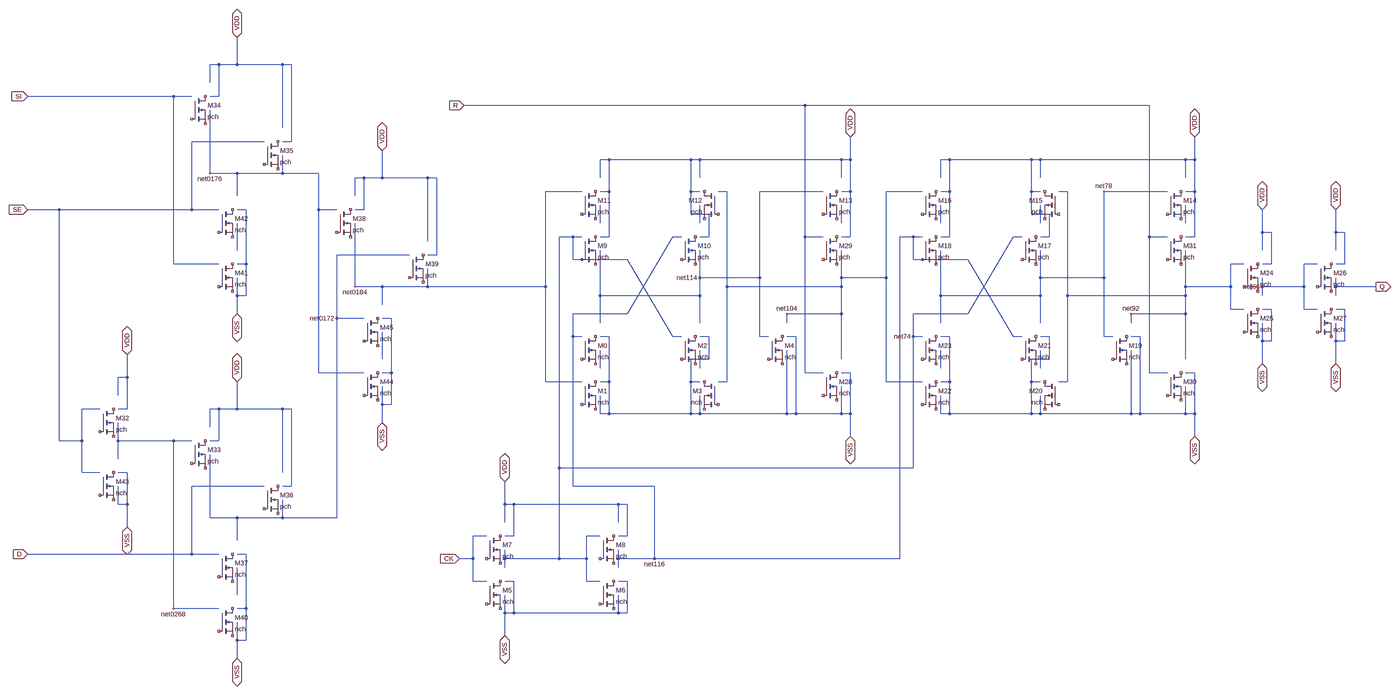
[diagram p0: schematic srff1.asc, whole sheet]
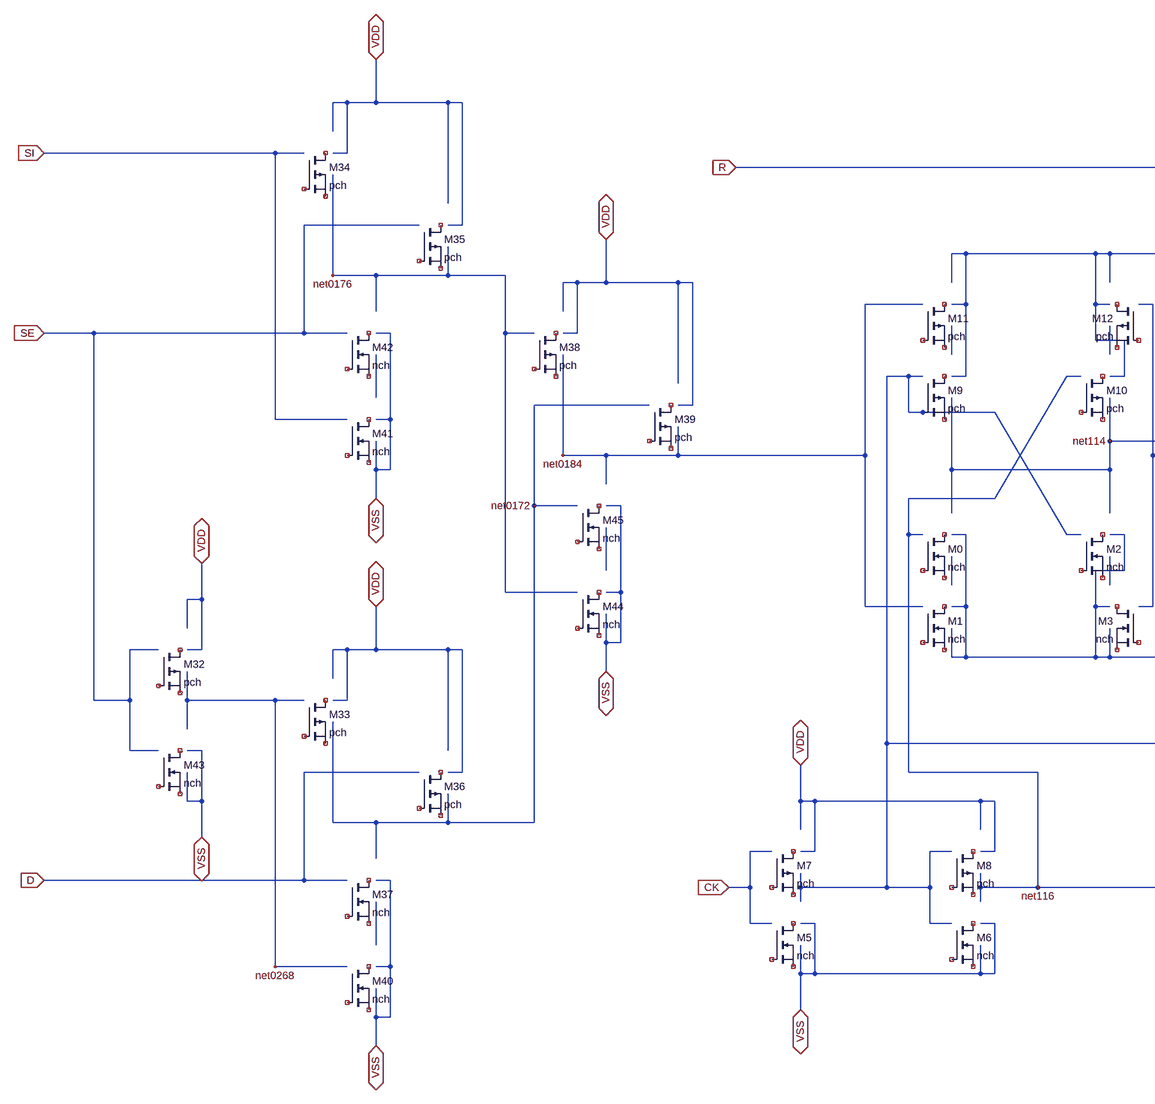
[diagram p1: schematic srff1.asc, part, row 1 of 1, column 1 of 2]
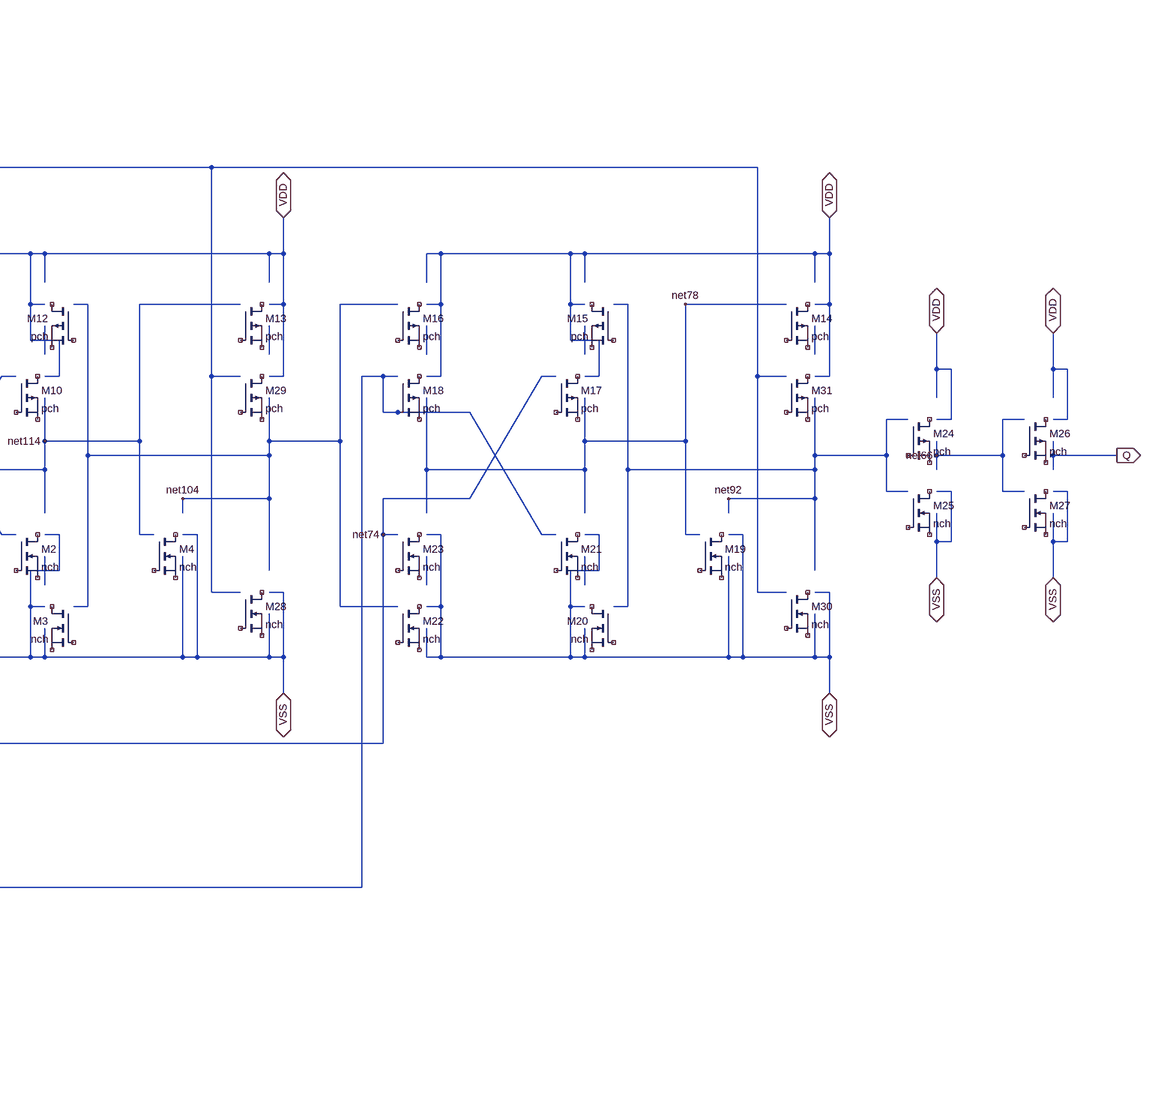
[diagram p2: schematic srff1.asc, part, row 1 of 1, column 2 of 2]
srff1.asc, the LTspice schematic file:
Version 4
SHEET 1 5408 2416
WIRE 960 928 960 736
WIRE 960 1040 960 928
WIRE 928 1040 928 976
WIRE 1440 1120 1472 1120
WIRE 1440 1312 1472 1312
WIRE 1472 1424 1472 1312
WIRE 1440 1424 1472 1424
WIRE 1440 1424 1440 1360
WIRE 1440 1488 1440 1424
WIRE 1472 1312 1472 1120
WIRE 432 1776 432 1856
WIRE 400 1776 432 1776
WIRE 432 1776 432 1664
WIRE 400 1776 400 1712
WIRE 400 1664 432 1664
WIRE 2912 1456 3072 1456
WIRE 3072 1456 3072 1360
WIRE 3104 1456 3104 1312
WIRE 3072 1456 3104 1456
WIRE 4224 1456 4256 1456
WIRE 4416 1456 4416 1360
WIRE 4256 1456 4416 1456
WIRE 4448 1456 4448 1312
WIRE 4416 1456 4448 1456
WIRE 928 1040 960 1040
WIRE 928 1104 928 1040
WIRE 928 1952 960 1952
WIRE 928 2144 960 2144
WIRE 960 2256 960 2144
WIRE 928 2256 960 2256
WIRE 928 2256 928 2192
WIRE 928 2320 928 2256
WIRE 960 2144 960 1952
WIRE 5152 1200 5152 1280
WIRE 5184 1200 5184 1088
WIRE 5152 1200 5184 1200
WIRE 5152 1088 5184 1088
WIRE 5152 1136 5152 1200
WIRE 4880 1200 4880 1280
WIRE 4912 1200 4912 1088
WIRE 4880 1200 4912 1200
WIRE 4880 1088 4912 1088
WIRE 4880 1136 4880 1200
WIRE 3552 1456 3552 1392
WIRE 3552 1456 3584 1456
WIRE 3904 1456 3904 1392
WIRE 3552 1184 3584 1184
WIRE 3584 1456 3872 1456
WIRE 3584 1456 3584 1344
WIRE 3584 1344 3584 1184
WIRE 3552 1344 3584 1344
WIRE 3904 1184 3936 1184
WIRE 3936 1264 3936 1184
WIRE 3872 1264 3936 1264
WIRE 3872 1456 3904 1456
WIRE 3872 1456 3872 1344
WIRE 3872 1344 3872 1264
WIRE 3872 1344 3904 1344
WIRE 4416 1312 4448 1312
WIRE 3904 1456 4224 1456
WIRE 4224 1456 4224 1232
WIRE 4224 1184 4256 1184
WIRE 4256 1456 4256 1184
WIRE 4448 1456 4448 1536
WIRE 1872 2160 1872 2240
WIRE 2272 2160 2304 2160
WIRE 2304 2160 2304 2048
WIRE 2272 2048 2304 2048
WIRE 1904 2160 1904 2048
WIRE 1872 2048 1904 2048
WIRE 1872 2096 1872 2160
WIRE 1872 2160 1904 2160
WIRE 2272 2096 2272 2160
WIRE 3072 1312 3104 1312
WIRE 3104 1456 3104 1536
WIRE 2880 1456 2912 1456
WIRE 2912 1456 2912 1184
WIRE 2880 1184 2912 1184
WIRE 2880 1456 2880 1232
WIRE 2560 1456 2880 1456
WIRE 2528 1344 2560 1344
WIRE 2528 1344 2528 1264
WIRE 2528 1456 2528 1344
WIRE 2528 1456 2560 1456
WIRE 2528 1264 2592 1264
WIRE 2592 1264 2592 1184
WIRE 2560 1184 2592 1184
WIRE 2208 1344 2240 1344
WIRE 2240 1344 2240 1184
WIRE 2240 1456 2240 1344
WIRE 2240 1456 2528 1456
WIRE 2208 1184 2240 1184
WIRE 2560 1456 2560 1392
WIRE 2208 1456 2240 1456
WIRE 2208 1456 2208 1392
WIRE 1904 2160 2272 2160
WIRE 928 736 960 736
WIRE 928 928 960 928
WIRE 4880 1008 5040 1008
WIRE 5040 1008 5040 928
WIRE 4880 1008 4880 976
WIRE 5040 1088 5040 1008
WIRE 5040 1088 5088 1088
WIRE 5040 928 5088 928
WIRE 4880 1040 4880 1008
WIRE 928 1344 928 1440
WIRE 928 1440 1088 1440
WIRE 1088 1440 1120 1440
WIRE 1120 1712 1120 1440
WIRE 1088 1712 1120 1712
WIRE 1088 1664 1088 1440
WIRE 864 1440 928 1440
WIRE 832 1504 832 1440
WIRE 832 1440 864 1440
WIRE 864 1552 864 1440
WIRE 832 1552 864 1552
WIRE 432 1248 432 1328
WIRE 400 1328 432 1328
WIRE 432 1440 432 1328
WIRE 400 1440 432 1440
WIRE 400 1392 400 1328
WIRE 3072 832 3104 832
WIRE 2560 560 3072 560
WIRE 3104 832 3104 672
WIRE 4416 832 4448 832
WIRE 4448 832 4448 672
WIRE 3904 560 4416 560
WIRE 4416 560 4448 560
WIRE 928 128 928 224
WIRE 928 224 1088 224
WIRE 1088 224 1120 224
WIRE 1120 496 1120 224
WIRE 1088 496 1120 496
WIRE 1088 448 1088 224
WIRE 864 224 928 224
WIRE 832 288 832 224
WIRE 832 224 864 224
WIRE 864 336 864 224
WIRE 832 336 864 336
WIRE 1344 736 1376 736
WIRE 1376 736 1376 624
WIRE 1344 624 1376 624
WIRE 1344 688 1344 624
WIRE 1376 624 1440 624
WIRE 1600 624 1632 624
WIRE 1440 624 1600 624
WIRE 1440 528 1440 624
WIRE 1600 896 1632 896
WIRE 1600 848 1600 624
WIRE 1632 896 1632 624
WIRE 5184 928 5184 816
WIRE 5152 816 5184 816
WIRE 5152 928 5184 928
WIRE 5152 880 5152 816
WIRE 5152 816 5152 736
WIRE 4912 928 4912 816
WIRE 4880 816 4912 816
WIRE 4880 928 4912 928
WIRE 4880 880 4880 816
WIRE 4880 816 4880 736
WIRE 3552 624 3552 560
WIRE 3552 560 3584 560
WIRE 3904 624 3904 560
WIRE 3904 832 3936 832
WIRE 3936 832 3936 752
WIRE 3872 752 3936 752
WIRE 3872 560 3904 560
WIRE 3872 752 3872 672
WIRE 3872 672 3872 560
WIRE 3872 672 3904 672
WIRE 3552 832 3584 832
WIRE 3584 560 3872 560
WIRE 3584 832 3584 672
WIRE 3584 672 3584 560
WIRE 3552 672 3584 672
WIRE 4416 624 4416 560
WIRE 4416 672 4448 672
WIRE 4448 672 4448 560
WIRE 4448 560 4448 480
WIRE 1872 1776 1872 1696
WIRE 2272 1776 2304 1776
WIRE 2304 1888 2304 1776
WIRE 2272 1888 2304 1888
WIRE 1904 1888 1904 1776
WIRE 1872 1888 1904 1888
WIRE 2272 1840 2272 1776
WIRE 1872 1840 1872 1776
WIRE 1872 1776 1904 1776
WIRE 3104 560 3104 480
WIRE 3104 672 3104 560
WIRE 3072 672 3104 672
WIRE 3072 624 3072 560
WIRE 3072 560 3104 560
WIRE 2208 672 2240 672
WIRE 2240 672 2240 560
WIRE 2240 832 2240 672
WIRE 2240 560 2528 560
WIRE 2208 832 2240 832
WIRE 2528 672 2560 672
WIRE 2528 672 2528 560
WIRE 2528 752 2528 672
WIRE 2528 560 2560 560
WIRE 2528 752 2592 752
WIRE 2592 832 2592 752
WIRE 2560 832 2592 832
WIRE 2560 624 2560 560
WIRE 2208 560 2240 560
WIRE 2208 624 2208 560
WIRE 1904 1776 2272 1776
WIRE 1440 1072 1440 1008
WIRE 1600 1008 1600 944
WIRE 1344 1008 1440 1008
WIRE 1440 1008 1600 1008
WIRE 1344 1008 1344 784
WIRE 1600 1008 2016 1008
WIRE 2016 1008 2016 672
WIRE 2016 1344 2144 1344
WIRE 2016 1344 2016 1008
WIRE 2016 672 2144 672
WIRE 2944 832 3008 832
WIRE 2944 1312 2944 832
WIRE 2944 1312 3008 1312
WIRE 2944 368 4288 368
WIRE 4288 832 4288 368
WIRE 4288 1312 4352 1312
WIRE 4288 832 4352 832
WIRE 2944 832 2944 368
WIRE 4288 1312 4288 832
WIRE 1728 368 2944 368
WIRE 4416 1104 4416 1040
WIRE 4224 1136 4224 1104
WIRE 4224 1104 4416 1104
WIRE 4416 1040 4416 1008
WIRE 4768 1088 4816 1088
WIRE 4768 928 4816 928
WIRE 4000 1040 4416 1040
WIRE 4416 1008 4416 880
WIRE 4416 1008 4768 1008
WIRE 4416 1264 4416 1104
WIRE 3968 672 4000 672
WIRE 3968 1344 4000 1344
WIRE 4000 1344 4000 1040
WIRE 4000 1040 4000 672
WIRE 4768 1008 4768 928
WIRE 4768 1088 4768 1008
WIRE 928 2096 928 2000
WIRE 928 688 928 608
WIRE 832 608 928 608
WIRE 928 608 1088 608
WIRE 1216 1312 1216 736
WIRE 1216 1312 1376 1312
WIRE 832 608 832 384
WIRE 1088 608 1088 544
WIRE 1216 736 1280 736
WIRE 1216 736 1216 608
WIRE 1088 608 1216 608
WIRE 3456 1184 3488 1184
WIRE 3456 1184 3456 1104
WIRE 3456 1104 3648 1104
WIRE 3808 832 3840 832
WIRE 3648 1104 3808 832
WIRE 2064 1648 3456 1648
WIRE 2064 1648 2064 832
WIRE 2064 1968 2064 1648
WIRE 2064 1968 2160 1968
WIRE 3456 1648 3456 1184
WIRE 2304 912 2464 1184
WIRE 1872 1968 2064 1968
WIRE 2160 1968 2160 1888
WIRE 2064 832 2112 832
WIRE 2160 2048 2160 1968
WIRE 1872 2000 1872 1968
WIRE 2160 1888 2208 1888
WIRE 2160 2048 2208 2048
WIRE 1872 1968 1872 1936
WIRE 2464 1184 2496 1184
WIRE 2112 912 2304 912
WIRE 2112 912 2112 832
WIRE 2112 832 2144 832
WIRE 4128 976 4128 672
WIRE 4128 672 4352 672
WIRE 3552 1136 3552 1040
WIRE 3904 1136 3904 1040
WIRE 3552 1040 3552 880
WIRE 3904 1040 3904 976
WIRE 3552 1040 3904 1040
WIRE 4128 1184 4128 976
WIRE 4128 1184 4160 1184
WIRE 3904 976 3904 880
WIRE 3904 976 4128 976
WIRE 2880 1136 2880 1104
WIRE 3072 1104 3072 1008
WIRE 2880 1104 3072 1104
WIRE 3072 976 3072 880
WIRE 3360 1344 3360 976
WIRE 3072 1008 3072 976
WIRE 3360 672 3488 672
WIRE 2656 1008 3072 1008
WIRE 2656 1008 2656 672
WIRE 3360 1344 3488 1344
WIRE 3072 1264 3072 1104
WIRE 2656 1344 2656 1008
WIRE 2624 1344 2656 1344
WIRE 3072 976 3360 976
WIRE 2624 672 2656 672
WIRE 3360 976 3360 672
WIRE 80 336 704 336
WIRE 704 928 704 336
WIRE 704 336 768 336
WIRE 704 928 864 928
WIRE 1440 1264 1440 1168
WIRE 2208 784 2208 720
WIRE 3904 784 3904 720
WIRE 1712 1968 1760 1968
WIRE 1760 1968 1760 1888
WIRE 1760 2048 1808 2048
WIRE 1760 2048 1760 1968
WIRE 1760 1888 1808 1888
WIRE 3552 784 3552 720
WIRE 3904 1296 3904 1232
WIRE 928 880 928 784
WIRE 2784 976 2784 672
WIRE 2560 976 2784 976
WIRE 2560 976 2560 880
WIRE 2784 1184 2816 1184
WIRE 2784 1184 2784 976
WIRE 2784 672 3008 672
WIRE 2208 1040 2560 1040
WIRE 2560 1040 2560 976
WIRE 2208 1040 2208 880
WIRE 2560 1136 2560 1040
WIRE 2208 1136 2208 1040
WIRE 2560 784 2560 720
WIRE 2208 1296 2208 1232
WIRE 4416 784 4416 720
WIRE 1280 1120 1280 896
WIRE 832 1824 832 1600
WIRE 1088 1824 1088 1760
WIRE 1280 1120 1376 1120
WIRE 1088 1824 1280 1824
WIRE 1280 1824 1280 1120
WIRE 928 1824 1088 1824
WIRE 832 1824 928 1824
WIRE 928 1904 928 1824
WIRE 1280 896 1536 896
WIRE 2400 1968 3408 1968
WIRE 3408 832 3456 832
WIRE 3456 832 3488 832
WIRE 3456 912 3456 832
WIRE 3456 912 3648 912
WIRE 3808 1184 3840 1184
WIRE 3648 912 3808 1184
WIRE 3408 1968 3408 832
WIRE 2272 1968 2272 1936
WIRE 2112 1712 2400 1712
WIRE 2272 1968 2400 1968
WIRE 2400 1968 2400 1712
WIRE 2112 1712 2112 1184
WIRE 2304 1104 2464 832
WIRE 2272 2000 2272 1968
WIRE 2464 832 2496 832
WIRE 2112 1104 2304 1104
WIRE 2112 1184 2112 1104
WIRE 2112 1184 2144 1184
WIRE 2560 1296 2560 1232
WIRE 3552 1296 3552 1232
WIRE 3072 784 3072 720
WIRE 768 1712 1024 1712
WIRE 768 1952 864 1952
WIRE 768 1952 768 1712
WIRE 80 1952 768 1952
WIRE 400 1552 400 1488
WIRE 400 1616 400 1552
WIRE 704 2144 864 2144
WIRE 704 1552 768 1552
WIRE 400 1552 704 1552
WIRE 704 2144 704 1552
WIRE 80 736 192 736
WIRE 768 736 768 496
WIRE 192 736 768 736
WIRE 768 736 864 736
WIRE 192 1552 192 736
WIRE 272 1552 272 1440
WIRE 272 1440 336 1440
WIRE 272 1664 336 1664
WIRE 272 1664 272 1552
WIRE 192 1552 272 1552
WIRE 768 496 1024 496
WIRE 5152 1008 5312 1008
WIRE 5152 1008 5152 976
WIRE 5152 1040 5152 1008
FLAG 4880 1008 net66
FLAG 1344 1008 net0184
FLAG 4224 1104 net92
FLAG 832 608 net0176
FLAG 3456 1184 net74
FLAG 4128 672 net78
FLAG 2880 1104 net104
FLAG 2560 976 net114
FLAG 1280 1120 net0172
FLAG 2400 1968 net116
FLAG 704 2144 net0268
SYMBOL PMOS 1280 736 R0
SYMATTR InstName M38
SYMATTR Value pch
SYMATTR Value2 w=6u l=1u
SYMBOL PMOS 1024 496 R0
SYMATTR InstName M35
SYMATTR Value pch
SYMATTR Value2 w=6u l=1u
SYMBOL PMOS 768 336 R0
SYMATTR InstName M34
SYMATTR Value pch
SYMATTR Value2 w=6u l=1u
SYMBOL PMOS 768 1552 R0
SYMATTR InstName M33
SYMATTR Value pch
SYMATTR Value2 w=6u l=1u
SYMBOL PMOS 1024 1712 R0
SYMATTR InstName M36
SYMATTR Value pch
SYMATTR Value2 w=6u l=1u
SYMBOL PMOS 3008 832 R0
SYMATTR InstName M29
SYMATTR Value pch
SYMATTR Value2 w=6u l=1u
SYMBOL PMOS 4352 832 R0
SYMATTR InstName M31
SYMATTR Value pch
SYMATTR Value2 w=6u l=1u
SYMBOL PMOS 5088 928 R0
SYMATTR InstName M26
SYMATTR Value pch
SYMATTR Value2 w=6u l=1u
SYMBOL PMOS 4816 928 R0
SYMATTR InstName M24
SYMATTR Value pch
SYMATTR Value2 w=6u l=1u
SYMBOL PMOS 3488 832 R0
SYMATTR InstName M18
SYMATTR Value pch
SYMATTR Value2 w=6u l=1u
SYMBOL PMOS 3840 832 R0
SYMATTR InstName M17
SYMATTR Value pch
SYMATTR Value2 w=6u l=1u
SYMBOL PMOS 3488 672 R0
SYMATTR InstName M16
SYMATTR Value pch
SYMATTR Value2 w=6u l=1u
SYMBOL PMOS 3968 672 M0
SYMATTR InstName M15
SYMATTR Value pch
SYMATTR Value2 w=6u l=1u
SYMBOL PMOS 4352 672 R0
SYMATTR InstName M14
SYMATTR Value pch
SYMATTR Value2 w=6u l=1u
SYMBOL PMOS 3008 672 R0
SYMATTR InstName M13
SYMATTR Value pch
SYMATTR Value2 w=6u l=1u
SYMBOL PMOS 2624 672 M0
SYMATTR InstName M12
SYMATTR Value pch
SYMATTR Value2 w=6u l=1u
SYMBOL PMOS 2144 672 R0
SYMATTR InstName M11
SYMATTR Value pch
SYMATTR Value2 w=6u l=1u
SYMBOL PMOS 2496 832 R0
SYMATTR InstName M10
SYMATTR Value pch
SYMATTR Value2 w=6u l=1u
SYMBOL PMOS 2144 832 R0
SYMATTR InstName M9
SYMATTR Value pch
SYMATTR Value2 w=6u l=1u
SYMBOL PMOS 2208 1888 R0
SYMATTR InstName M8
SYMATTR Value pch
SYMATTR Value2 w=6u l=1u
SYMBOL PMOS 1808 1888 R0
SYMATTR InstName M7
SYMATTR Value pch
SYMATTR Value2 w=6u l=1u
SYMBOL PMOS 1536 896 R0
SYMATTR InstName M39
SYMATTR Value pch
SYMATTR Value2 w=6u l=1u
SYMBOL PMOS 336 1440 R0
SYMATTR InstName M32
SYMATTR Value pch
SYMATTR Value2 w=6u l=1u
SYMBOL NMOS 864 1952 R0
SYMATTR InstName M37
SYMATTR Value nch
SYMATTR Value2 w=2u l=1u
SYMBOL NMOS 864 2144 R0
SYMATTR InstName M40
SYMATTR Value nch
SYMATTR Value2 w=2u l=1u
SYMBOL NMOS 864 928 R0
SYMATTR InstName M41
SYMATTR Value nch
SYMATTR Value2 w=2u l=1u
SYMBOL NMOS 864 736 R0
SYMATTR InstName M42
SYMATTR Value nch
SYMATTR Value2 w=2u l=1u
SYMBOL NMOS 336 1664 R0
SYMATTR InstName M43
SYMATTR Value nch
SYMATTR Value2 w=2u l=1u
SYMBOL NMOS 1376 1312 R0
SYMATTR InstName M44
SYMATTR Value nch
SYMATTR Value2 w=2u l=1u
SYMBOL NMOS 1376 1120 R0
SYMATTR InstName M45
SYMATTR Value nch
SYMATTR Value2 w=2u l=1u
SYMBOL NMOS 5088 1088 R0
SYMATTR InstName M27
SYMATTR Value nch
SYMATTR Value2 w=2u l=1u
SYMBOL NMOS 4816 1088 R0
SYMATTR InstName M25
SYMATTR Value nch
SYMATTR Value2 w=2u l=1u
SYMBOL NMOS 3488 1184 R0
SYMATTR InstName M23
SYMATTR Value nch
SYMATTR Value2 w=2u l=1u
SYMBOL NMOS 3488 1344 R0
SYMATTR InstName M22
SYMATTR Value nch
SYMATTR Value2 w=2u l=1u
SYMBOL NMOS 3840 1184 R0
SYMATTR InstName M21
SYMATTR Value nch
SYMATTR Value2 w=2u l=1u
SYMBOL NMOS 3968 1344 M0
SYMATTR InstName M20
SYMATTR Value nch
SYMATTR Value2 w=2u l=1u
SYMBOL NMOS 4160 1184 R0
SYMATTR InstName M19
SYMATTR Value nch
SYMATTR Value2 w=2u l=1u
SYMBOL NMOS 4352 1312 R0
SYMATTR InstName M30
SYMATTR Value nch
SYMATTR Value2 w=2u l=1u
SYMBOL NMOS 3008 1312 R0
SYMATTR InstName M28
SYMATTR Value nch
SYMATTR Value2 w=2u l=1u
SYMBOL NMOS 2208 2048 R0
SYMATTR InstName M6
SYMATTR Value nch
SYMATTR Value2 w=2u l=1u
SYMBOL NMOS 1808 2048 R0
SYMATTR InstName M5
SYMATTR Value nch
SYMATTR Value2 w=2u l=1u
SYMBOL NMOS 2816 1184 R0
SYMATTR InstName M4
SYMATTR Value nch
SYMATTR Value2 w=2u l=1u
SYMBOL NMOS 2624 1344 M0
SYMATTR InstName M3
SYMATTR Value nch
SYMATTR Value2 w=2u l=1u
SYMBOL NMOS 2496 1184 R0
SYMATTR InstName M2
SYMATTR Value nch
SYMATTR Value2 w=2u l=1u
SYMBOL NMOS 2144 1344 R0
SYMATTR InstName M1
SYMATTR Value nch
SYMATTR Value2 w=2u l=1u
SYMBOL NMOS 2144 1184 R0
SYMATTR InstName M0
SYMATTR Value nch
SYMATTR Value2 w=2u l=1u
FLAG 5312 1008 Q
IOPIN 5312 1008 Out
FLAG 928 2320 VSS
IOPIN 928 2320 BiDir
FLAG 928 1104 VSS
IOPIN 928 1104 BiDir
FLAG 432 1248 VDD
IOPIN 432 1248 BiDir
FLAG 432 1856 VSS
IOPIN 432 1856 BiDir
FLAG 1440 1488 VSS
IOPIN 1440 1488 BiDir
FLAG 1440 528 VDD
IOPIN 1440 528 BiDir
FLAG 928 128 VDD
IOPIN 928 128 BiDir
FLAG 928 1344 VDD
IOPIN 928 1344 BiDir
FLAG 5152 736 VDD
IOPIN 5152 736 BiDir
FLAG 5152 1280 VSS
IOPIN 5152 1280 BiDir
FLAG 4880 736 VDD
IOPIN 4880 736 BiDir
FLAG 4880 1280 VSS
IOPIN 4880 1280 BiDir
FLAG 4448 1536 VSS
IOPIN 4448 1536 BiDir
FLAG 4448 480 VDD
IOPIN 4448 480 BiDir
FLAG 1872 1696 VDD
IOPIN 1872 1696 BiDir
FLAG 1872 2240 VSS
IOPIN 1872 2240 BiDir
FLAG 3104 1536 VSS
IOPIN 3104 1536 BiDir
FLAG 3104 480 VDD
IOPIN 3104 480 BiDir
FLAG 80 336 SI
IOPIN 80 336 In
FLAG 80 1952 D
IOPIN 80 1952 In
FLAG 80 736 SE
IOPIN 80 736 In
FLAG 1728 368 R
IOPIN 1728 368 In
FLAG 1712 1968 CK
IOPIN 1712 1968 In

The netlist it stands for:
* srff1.asc
* M38: pch w=6u l=1u (symbol PMOS not certain, pin order unknown); nets seen at it: 
* M35: pch w=6u l=1u (symbol PMOS not certain, pin order unknown); nets seen at it: 
* M34: pch w=6u l=1u (symbol PMOS not certain, pin order unknown); nets seen at it: 
* M33: pch w=6u l=1u (symbol PMOS not certain, pin order unknown); nets seen at it: 
* M36: pch w=6u l=1u (symbol PMOS not certain, pin order unknown); nets seen at it: 
* M29: pch w=6u l=1u (symbol PMOS not certain, pin order unknown); nets seen at it: 
* M31: pch w=6u l=1u (symbol PMOS not certain, pin order unknown); nets seen at it: 
* M26: pch w=6u l=1u (symbol PMOS not certain, pin order unknown); nets seen at it: 
* M24: pch w=6u l=1u (symbol PMOS not certain, pin order unknown); nets seen at it: 
* M18: pch w=6u l=1u (symbol PMOS not certain, pin order unknown); nets seen at it: net116
* M17: pch w=6u l=1u (symbol PMOS not certain, pin order unknown); nets seen at it: 
* M16: pch w=6u l=1u (symbol PMOS not certain, pin order unknown); nets seen at it: 
* M15: pch w=6u l=1u (symbol PMOS not certain, pin order unknown); nets seen at it: 
* M14: pch w=6u l=1u (symbol PMOS not certain, pin order unknown); nets seen at it: 
* M13: pch w=6u l=1u (symbol PMOS not certain, pin order unknown); nets seen at it: 
* M12: pch w=6u l=1u (symbol PMOS not certain, pin order unknown); nets seen at it: 
* M11: pch w=6u l=1u (symbol PMOS not certain, pin order unknown); nets seen at it: 
* M10: pch w=6u l=1u (symbol PMOS not certain, pin order unknown); nets seen at it: 
* M9: pch w=6u l=1u (symbol PMOS not certain, pin order unknown); nets seen at it: net74
* M8: pch w=6u l=1u (symbol PMOS not certain, pin order unknown); nets seen at it: 
* M7: pch w=6u l=1u (symbol PMOS not certain, pin order unknown); nets seen at it: 
* M39: pch w=6u l=1u (symbol PMOS not certain, pin order unknown); nets seen at it: 
* M32: pch w=6u l=1u (symbol PMOS not certain, pin order unknown); nets seen at it: 
* M37: nch w=2u l=1u (symbol NMOS not certain, pin order unknown); nets seen at it: 
* M40: nch w=2u l=1u (symbol NMOS not certain, pin order unknown); nets seen at it: 
* M41: nch w=2u l=1u (symbol NMOS not certain, pin order unknown); nets seen at it: 
* M42: nch w=2u l=1u (symbol NMOS not certain, pin order unknown); nets seen at it: 
* M43: nch w=2u l=1u (symbol NMOS not certain, pin order unknown); nets seen at it: 
* M44: nch w=2u l=1u (symbol NMOS not certain, pin order unknown); nets seen at it: 
* M45: nch w=2u l=1u (symbol NMOS not certain, pin order unknown); nets seen at it: 
* M27: nch w=2u l=1u (symbol NMOS not certain, pin order unknown); nets seen at it: 
* M25: nch w=2u l=1u (symbol NMOS not certain, pin order unknown); nets seen at it: 
* M23: nch w=2u l=1u (symbol NMOS not certain, pin order unknown); nets seen at it: 
* M22: nch w=2u l=1u (symbol NMOS not certain, pin order unknown); nets seen at it: 
* M21: nch w=2u l=1u (symbol NMOS not certain, pin order unknown); nets seen at it: 
* M20: nch w=2u l=1u (symbol NMOS not certain, pin order unknown); nets seen at it: 
* M19: nch w=2u l=1u (symbol NMOS not certain, pin order unknown); nets seen at it: 
* M30: nch w=2u l=1u (symbol NMOS not certain, pin order unknown); nets seen at it: 
* M28: nch w=2u l=1u (symbol NMOS not certain, pin order unknown); nets seen at it: 
* M6: nch w=2u l=1u (symbol NMOS not certain, pin order unknown); nets seen at it: 
* M5: nch w=2u l=1u (symbol NMOS not certain, pin order unknown); nets seen at it: 
* M4: nch w=2u l=1u (symbol NMOS not certain, pin order unknown); nets seen at it: 
* M3: nch w=2u l=1u (symbol NMOS not certain, pin order unknown); nets seen at it: 
* M2: nch w=2u l=1u (symbol NMOS not certain, pin order unknown); nets seen at it: 
* M1: nch w=2u l=1u (symbol NMOS not certain, pin order unknown); nets seen at it: 
* M0: nch w=2u l=1u (symbol NMOS not certain, pin order unknown); nets seen at it: 
.backanno
.end